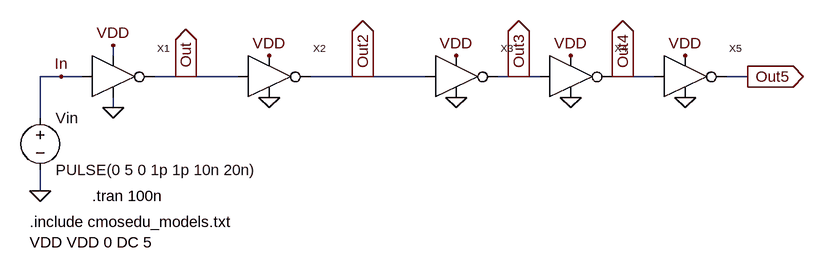
[diagram p0: schematic Inverter_sim_tran.asc]
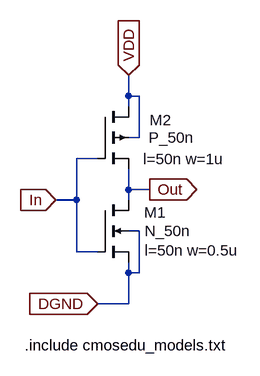
[diagram p1: sub-circuit inverter.asc]
Inverter_sim_tran.asc, the LTspice schematic file:
Version 4
SHEET 1 1236 680
WIRE 144 144 144 128
WIRE 64 176 32 176
WIRE 96 176 64 176
WIRE 256 176 208 176
WIRE 336 176 256 176
WIRE 528 176 448 176
WIRE 624 176 528 176
WIRE 768 176 736 176
WIRE 800 176 768 176
WIRE 928 176 912 176
WIRE 976 176 928 176
WIRE 1120 176 1088 176
WIRE 144 224 144 208
WIRE 32 240 32 176
WIRE 32 352 32 320
FLAG 64 176 In
FLAG 256 176 Out
IOPIN 256 176 Out
FLAG 32 352 0
FLAG 144 224 0
FLAG 144 128 VDD
FLAG 528 176 Out2
IOPIN 528 176 Out
FLAG 384 144 VDD
FLAG 384 208 0
FLAG 672 208 0
FLAG 848 208 0
FLAG 1024 208 0
FLAG 1024 144 VDD
FLAG 848 144 VDD
FLAG 672 144 VDD
FLAG 768 176 Out3
IOPIN 768 176 Out
FLAG 928 176 Out4
IOPIN 928 176 Out
FLAG 1120 176 Out5
IOPIN 1120 176 Out
SYMBOL voltage 32 224 R0
WINDOW 123 0 0 Left 0
WINDOW 39 0 0 Left 0
SYMATTR InstName Vin
SYMATTR Value PULSE(0 5 0 1p 1p 10n 20n)
SYMBOL Inverter 112 176 R0
SYMATTR InstName X1
SYMBOL Inverter 352 176 R0
SYMATTR InstName X2
SYMBOL Inverter 640 176 R0
SYMATTR InstName X3
SYMBOL Inverter 816 176 R0
SYMATTR InstName X4
SYMBOL Inverter 992 176 R0
SYMATTR InstName X5
TEXT 16 400 Left 0 !.include cmosedu_models.txt\nVDD VDD 0 DC 5
TEXT 112 360 Left 0 !.tran 100n

inverter.asc, the sub-circuit schematic file:
Version 4
SHEET 1 880 680
WIRE 176 16 176 -16
WIRE 192 16 176 16
WIRE 176 32 176 16
WIRE 192 80 192 16
WIRE 192 80 176 80
WIRE 128 112 96 112
WIRE 176 160 176 128
WIRE 208 160 176 160
WIRE 96 176 96 112
WIRE 96 176 64 176
WIRE 176 176 176 160
WIRE 192 224 176 224
WIRE 96 256 96 176
WIRE 128 256 96 256
WIRE 176 288 176 272
WIRE 192 288 192 224
WIRE 192 288 176 288
WIRE 176 336 176 288
WIRE 176 336 128 336
FLAG 176 -16 VDD
IOPIN 176 -16 In
FLAG 64 176 In
IOPIN 64 176 In
FLAG 208 160 Out
IOPIN 208 160 Out
FLAG 128 336 DGND
IOPIN 128 336 In
SYMBOL nmos4 128 176 R0
WINDOW 0 72 19 Left 0
WINDOW 3 73 48 Left 0
WINDOW 123 73 78 Left 0
SYMATTR InstName M1
SYMATTR Value N_50n
SYMATTR Value2 l=50n w=0.5u
SYMBOL pmos4 128 32 R0
WINDOW 0 80 21 Left 0
WINDOW 3 79 48 Left 0
WINDOW 123 70 81 Left 0
SYMATTR InstName M2
SYMATTR Value P_50n
SYMATTR Value2 l=50n w=1u
TEXT 16 400 Left 0 !.include cmosedu_models.txt

The netlist it stands for:
* Inverter_sim_tran.asc
Vin In 0 PULSE(0 5 0 1p 1p 10n 20n)
XX1 In Out VDD 0 inverter
XX2 Out Out2 VDD 0 inverter
XX3 Out2 Out3 VDD 0 inverter
XX4 Out3 Out4 VDD 0 inverter
XX5 Out4 Out5 VDD 0 inverter

* block symbol definitions
.subckt inverter In Out VDD DGND
M1 Out In DGND DGND N_50n l=50n w=0.5u
M2 VDD In Out VDD P_50n l=50n w=1u
.include cmosedu_models.txt
.ends inverter

.model NMOS NMOS
.model PMOS PMOS
.lib standard.mos
.include cmosedu_models.txt
VDD VDD 0 DC 5
.tran 100n
.backanno
.end

* Results of the author's LTspice run, read from the files saved beside the schematic
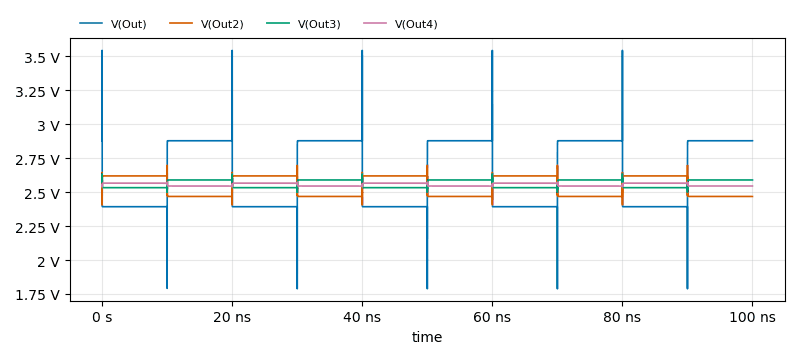
[diagram p2: Transient Analysis of Inverter_sim_tran.asc, plotted from the saved traces]
* Transient Analysis, 1 run:
*   V(Out): min 1.788 V, max 3.544 V, average 2.635 V, rms 2.647 V, last 2.878 V
*   V(Out2): min 2.405 V, max 2.698 V, average 2.544 V, rms 2.545 V, last 2.468 V
*   V(Out3): min 2.497 V, max 2.634 V, average 2.561 V, rms 2.561 V, last 2.589 V
*   V(Out4): min 2.539 V, max 2.573 V, average 2.556 V, rms 2.556 V, last 2.545 V